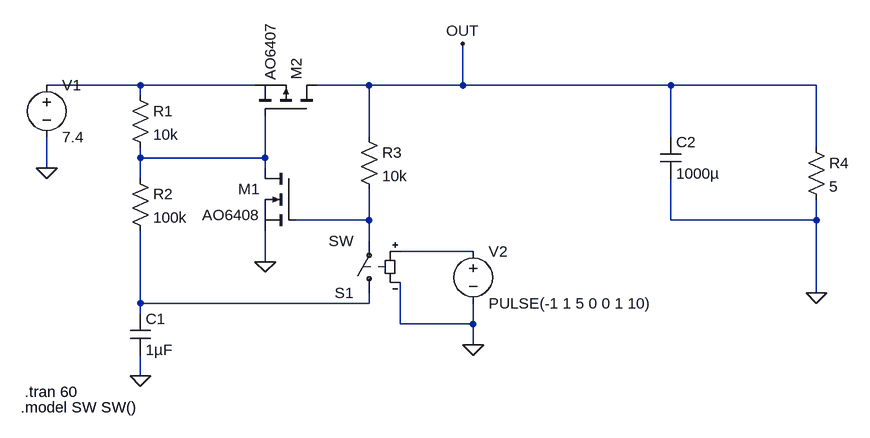
[diagram p0: schematic switch.asc]
switch.asc, the LTspice schematic file:
Version 4
SHEET 1 880 680
WIRE -288 0 -432 0
WIRE -112 0 -288 0
WIRE 64 0 -16 0
WIRE 208 0 208 -64
WIRE 208 0 64 0
WIRE 528 0 208 0
WIRE 752 0 528 0
WIRE -288 16 -288 0
WIRE 64 80 64 0
WIRE 528 80 528 0
WIRE 752 96 752 0
WIRE -288 112 -288 96
WIRE -96 112 -96 48
WIRE -96 112 -288 112
WIRE -432 128 -432 80
WIRE -96 128 -96 112
WIRE -288 144 -288 112
WIRE 64 208 64 160
WIRE 64 208 -48 208
WIRE 528 208 528 144
WIRE 752 208 752 176
WIRE 752 208 528 208
WIRE 64 240 64 208
WIRE 224 256 112 256
WIRE -96 272 -96 224
WIRE 752 320 752 208
WIRE -288 336 -288 224
WIRE 64 336 64 320
WIRE 64 336 -288 336
WIRE -288 352 -288 336
WIRE 112 368 112 304
WIRE 224 368 224 336
WIRE 224 368 112 368
WIRE 224 400 224 368
WIRE -288 448 -288 416
FLAG -96 272 0
FLAG -432 128 0
FLAG 208 -64 OUT
FLAG -288 448 0
FLAG 224 400 0
FLAG 752 320 0
SYMBOL nmos -48 128 M0
SYMATTR InstName M1
SYMATTR Value AO6408
SYMBOL pmos -16 48 M270
SYMATTR InstName M2
SYMATTR Value AO6407
SYMBOL res -304 0 R0
SYMATTR InstName R1
SYMATTR Value 10k
SYMBOL res -304 128 R0
SYMATTR InstName R2
SYMATTR Value 100k
SYMBOL res 48 64 R0
SYMATTR InstName R3
SYMATTR Value 10k
SYMBOL voltage -432 -16 R0
WINDOW 123 0 0 Left 2
WINDOW 39 0 0 Left 2
SYMATTR InstName V1
SYMATTR Value 7.4
SYMBOL cap -304 352 R0
SYMATTR InstName C1
SYMATTR Value 1µF
SYMBOL voltage 224 240 R0
WINDOW 123 0 0 Left 2
WINDOW 39 0 0 Left 2
SYMATTR InstName V2
SYMATTR Value PULSE(-1 1 5 0 0 1 10)
SYMBOL sw 64 336 R180
SYMATTR InstName S1
SYMBOL res 736 80 R0
SYMATTR InstName R4
SYMATTR Value 5
SYMBOL cap 512 80 R0
SYMATTR InstName C2
SYMATTR Value 1000µ
TEXT -466 472 Left 2 !.tran 60
TEXT -472 496 Left 2 !.model SW SW()

The netlist it stands for:
* switch.asc
M1 N002 N003 0 0 AO6408
M2 OUT N002 N001 N001 AO6407
R1 N001 N002 10k
R2 N002 N005 100k
R3 OUT N003 10k
V1 N001 0 7.4
C1 N005 0 1µF
V2 N004 0 PULSE(-1 1 5 0 0 1 10)
S1 N005 N003 N004 0 SW
R4 OUT 0 5
C2 OUT 0 1000µ
.model NMOS NMOS
.model PMOS PMOS
.lib standard.mos
.tran 60
.model SW SW()
.backanno
.end